# EAGLE schematic attenuverter (EAGLE 7.5.0)
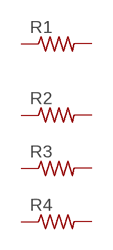
[diagram p0: schematic, sheet 1]

## Parts
R1  R-US_0207/7  [0207/7]
R2  R-US_0207/7  [0207/7]
R3  R-US_0207/7  [0207/7]
R4  R-US_0207/7  [0207/7]
Unconnected: R1.1 R1.2 R2.1 R2.2 R3.1 R3.2 R4.1 R4.2

## Library data of the parts
R1-R4 = resistor:R-US_: RESISTOR, American symbol